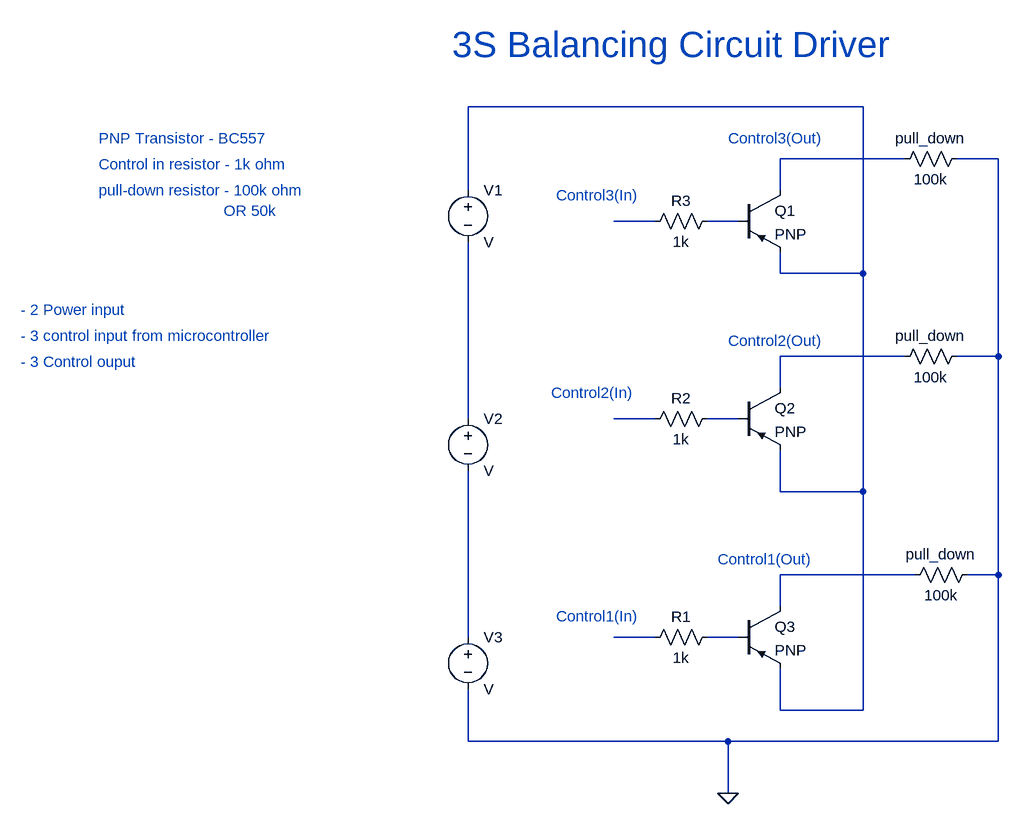
[diagram p0: schematic 3S Balancing Driver circuit.asc]
3S Balancing Driver circuit.asc, the LTspice schematic file:
Version 4
SHEET 1 880 980
WIRE 384 -96 -224 -96
WIRE 448 -16 256 -16
WIRE 592 -16 528 -16
WIRE -224 32 -224 -96
WIRE 256 32 256 -16
WIRE 64 80 0 80
WIRE 192 80 144 80
WIRE 256 160 256 128
WIRE 384 160 384 -96
WIRE 384 160 256 160
WIRE 448 288 256 288
WIRE 592 288 592 -16
WIRE 592 288 528 288
WIRE 256 336 256 288
WIRE -224 384 -224 112
WIRE 64 384 0 384
WIRE 192 384 144 384
WIRE 256 496 256 432
WIRE 384 496 384 160
WIRE 384 496 256 496
WIRE 464 624 256 624
WIRE 592 624 592 288
WIRE 592 624 544 624
WIRE 256 672 256 624
WIRE -224 720 -224 464
WIRE 64 720 0 720
WIRE 192 720 144 720
WIRE 256 832 256 768
WIRE 384 832 384 496
WIRE 384 832 256 832
WIRE -224 880 -224 800
WIRE 176 880 -224 880
WIRE 592 880 592 624
WIRE 592 880 176 880
WIRE 176 960 176 880
FLAG 176 960 0
SYMBOL pnp 192 32 R0
SYMATTR InstName Q1
SYMBOL pnp 192 336 R0
SYMATTR InstName Q2
SYMBOL pnp 192 672 R0
SYMATTR InstName Q3
SYMBOL voltage -224 16 R0
SYMATTR InstName V1
SYMBOL voltage -224 368 R0
SYMATTR InstName V2
SYMBOL voltage -224 704 R0
SYMATTR InstName V3
SYMBOL res 160 704 R90
WINDOW 0 0 56 VBottom 2
WINDOW 3 32 56 VTop 2
SYMATTR InstName R1
SYMATTR Value 1k
SYMBOL res 160 368 R90
WINDOW 0 0 56 VBottom 2
WINDOW 3 32 56 VTop 2
SYMATTR InstName R2
SYMATTR Value 1k
SYMBOL res 160 64 R90
WINDOW 0 0 56 VBottom 2
WINDOW 3 32 56 VTop 2
SYMATTR InstName R3
SYMATTR Value 1k
SYMBOL res 560 608 R90
WINDOW 0 0 56 VBottom 2
WINDOW 3 32 56 VTop 2
SYMATTR InstName pull_down
SYMATTR Value 100k
SYMBOL res 544 -32 R90
WINDOW 0 0 56 VBottom 2
WINDOW 3 32 56 VTop 2
SYMATTR InstName pull_down
SYMATTR Value 100k
SYMBOL res 544 272 R90
WINDOW 0 0 56 VBottom 2
WINDOW 3 32 56 VTop 2
SYMATTR InstName pull_down
SYMATTR Value 100k
TEXT -88 688 Left 2 ;Control1(In)
TEXT -96 344 Left 2 ;Control2(In)
TEXT -88 40 Left 2 ;Control3(In)
TEXT 176 -48 Left 2 ;Control3(Out)
TEXT 176 264 Left 2 ;Control2(Out)
TEXT 160 600 Left 2 ;Control1(Out)
TEXT -248 -192 Left 5 ;3S Balancing Circuit Driver
TEXT -792 -48 Left 2 ;PNP Transistor - BC557
TEXT -792 -8 Left 2 ;Control in resistor - 1k ohm
TEXT -792 32 Left 2 ;pull-down resistor - 100k ohm
TEXT -600 64 Left 2 ;OR 50k
TEXT -912 256 Left 2 ;- 3 control input from microcontroller
TEXT -912 216 Left 2 ;- 2 Power input
TEXT -912 296 Left 2 ;- 3 Control ouput

The netlist it stands for:
* 3S Balancing Driver circuit.asc
Q1 N002 N004 N001 0 PNP
Q2 N005 N008 N001 0 PNP
Q3 N009 N012 N001 0 PNP
V1 N001 N006 V
V2 N006 N010 V
V3 N010 0 V
R1 N012 N011 1k
R2 N008 N007 1k
R3 N004 N003 1k
R§pull_down 0 N009 100k
R§pull_down 0 N002 100k
R§pull_down 0 N005 100k
.model NPN NPN
.model PNP PNP
.lib standard.bjt
* Control1(In)
* Control2(In)
* Control3(In)
* Control3(Out)
* Control2(Out)
* Control1(Out)
* 3S Balancing Circuit Driver
* PNP Transistor - BC557
* Control in resistor - 1k ohm
* pull-down resistor - 100k ohm
* OR 50k
* - 3 control input from microcontroller
* - 2 Power input
* - 3 Control ouput
.backanno
.end